# Altium schematic sheet USERPWR.SchDoc: USER HEADER POWER
size A4; Organization: Altium Limited.; Address1: Level 3, 12a Rodborough Rd; Address2: Frenchs Forest 2086; Address3: NSW; Address4: AUSTRALIA; DocumentNumber: 25; SheetNumber: 26; SheetTotal: 78
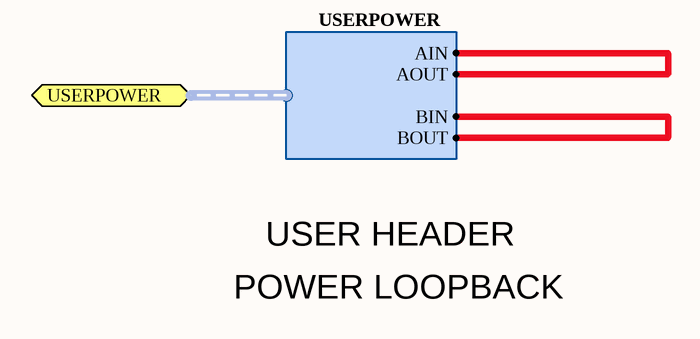
[diagram p0: USERPWR.SchDoc]

## Ports
USERPOWER (harness USERPOWER)

## Harnesses
USERPOWER: AIN, BIN, AOUT, BOUT

## Nets
(unnamed): port USERPOWER.AIN, port USERPOWER.AOUT
(unnamed): port USERPOWER.BIN, port USERPOWER.BOUT

## Notes on the sheet
- POWER LOOPBACK
- USER HEADER
- Sheet Title
- Project Title
- Size:
- Date:
- A4
- Assy:
- Time:
- Revision:
- Sheet
- of
- File: